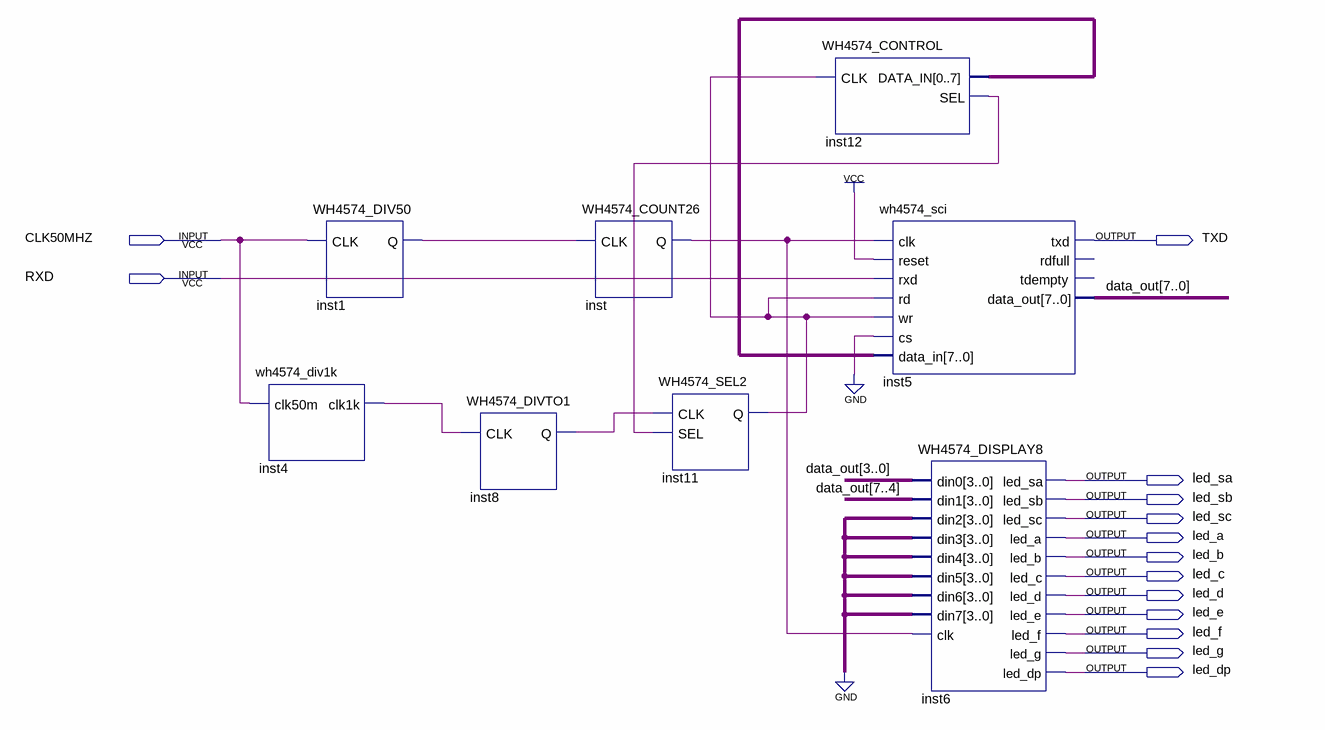
[diagram p0: schematic sheet]
// Quartus schematic WH4574_USART_ALL.bdf as structural Verilog: 8 symbols, 14 pins
module WH4574_USART_ALL (
  input  CLK50MHZ,
  input  RXD,
  output TXD,
  output led_sa,
  output led_sb,
  output led_sc,
  output led_a,
  output led_b,
  output led_c,
  output led_d,
  output led_e,
  output led_f,
  output led_g,
  output led_dp
);

  wire inst1_q, inst4_clk1k, inst8_q, inst11_q, inst12_sel, inst_q;
  wire [7:0] data_out, inst12_data_in;

  WH4574_DIV50 inst1 (.CLK(CLK50MHZ), .Q(inst1_q));
  wh4574_div1k inst4 (.clk50m(CLK50MHZ), .clk1k(inst4_clk1k));
  WH4574_DIVTO1 inst8 (.CLK(inst4_clk1k), .Q(inst8_q));
  WH4574_COUNT26 inst (.CLK(inst1_q), .Q(inst_q));
  WH4574_SEL2 inst11 (.CLK(inst8_q), .SEL(inst12_sel), .Q(inst11_q));
  WH4574_CONTROL inst12 (.CLK(inst11_q), .DATA_IN(inst12_data_in), .SEL(inst12_sel));
  wh4574_sci inst5 (
    .clk(inst_q), .reset(1'b1), .rxd(RXD), .rd(inst11_q), .wr(inst11_q), .cs(1'b0), .data_in(inst12_data_in),
    .txd(TXD), .data_out(data_out));  // open: rdfull, tdempty
  WH4574_DISPLAY8 inst6 (
    .din0(data_out[3:0]), .din1(data_out[7:4]), .din2(4'b0000), .din3(4'b0000), .din4(4'b0000),
    .din5(4'b0000), .din6(4'b0000), .din7(4'b0000), .clk(inst_q), .led_sa(led_sa), .led_sb(led_sb),
    .led_sc(led_sc), .led_a(led_a), .led_b(led_b), .led_c(led_c), .led_d(led_d), .led_e(led_e),
    .led_f(led_f), .led_g(led_g), .led_dp(led_dp));
endmodule
